# Altium schematic sheet 21_POWER_DOMAINS.SchDoc: Power Domains
size B; Author: Edward Lai; CompanyName: Vibe Inc; DrawnBy: Edward Lai; DocumentNumber: 10; SheetNumber: 10; SheetTotal: 12
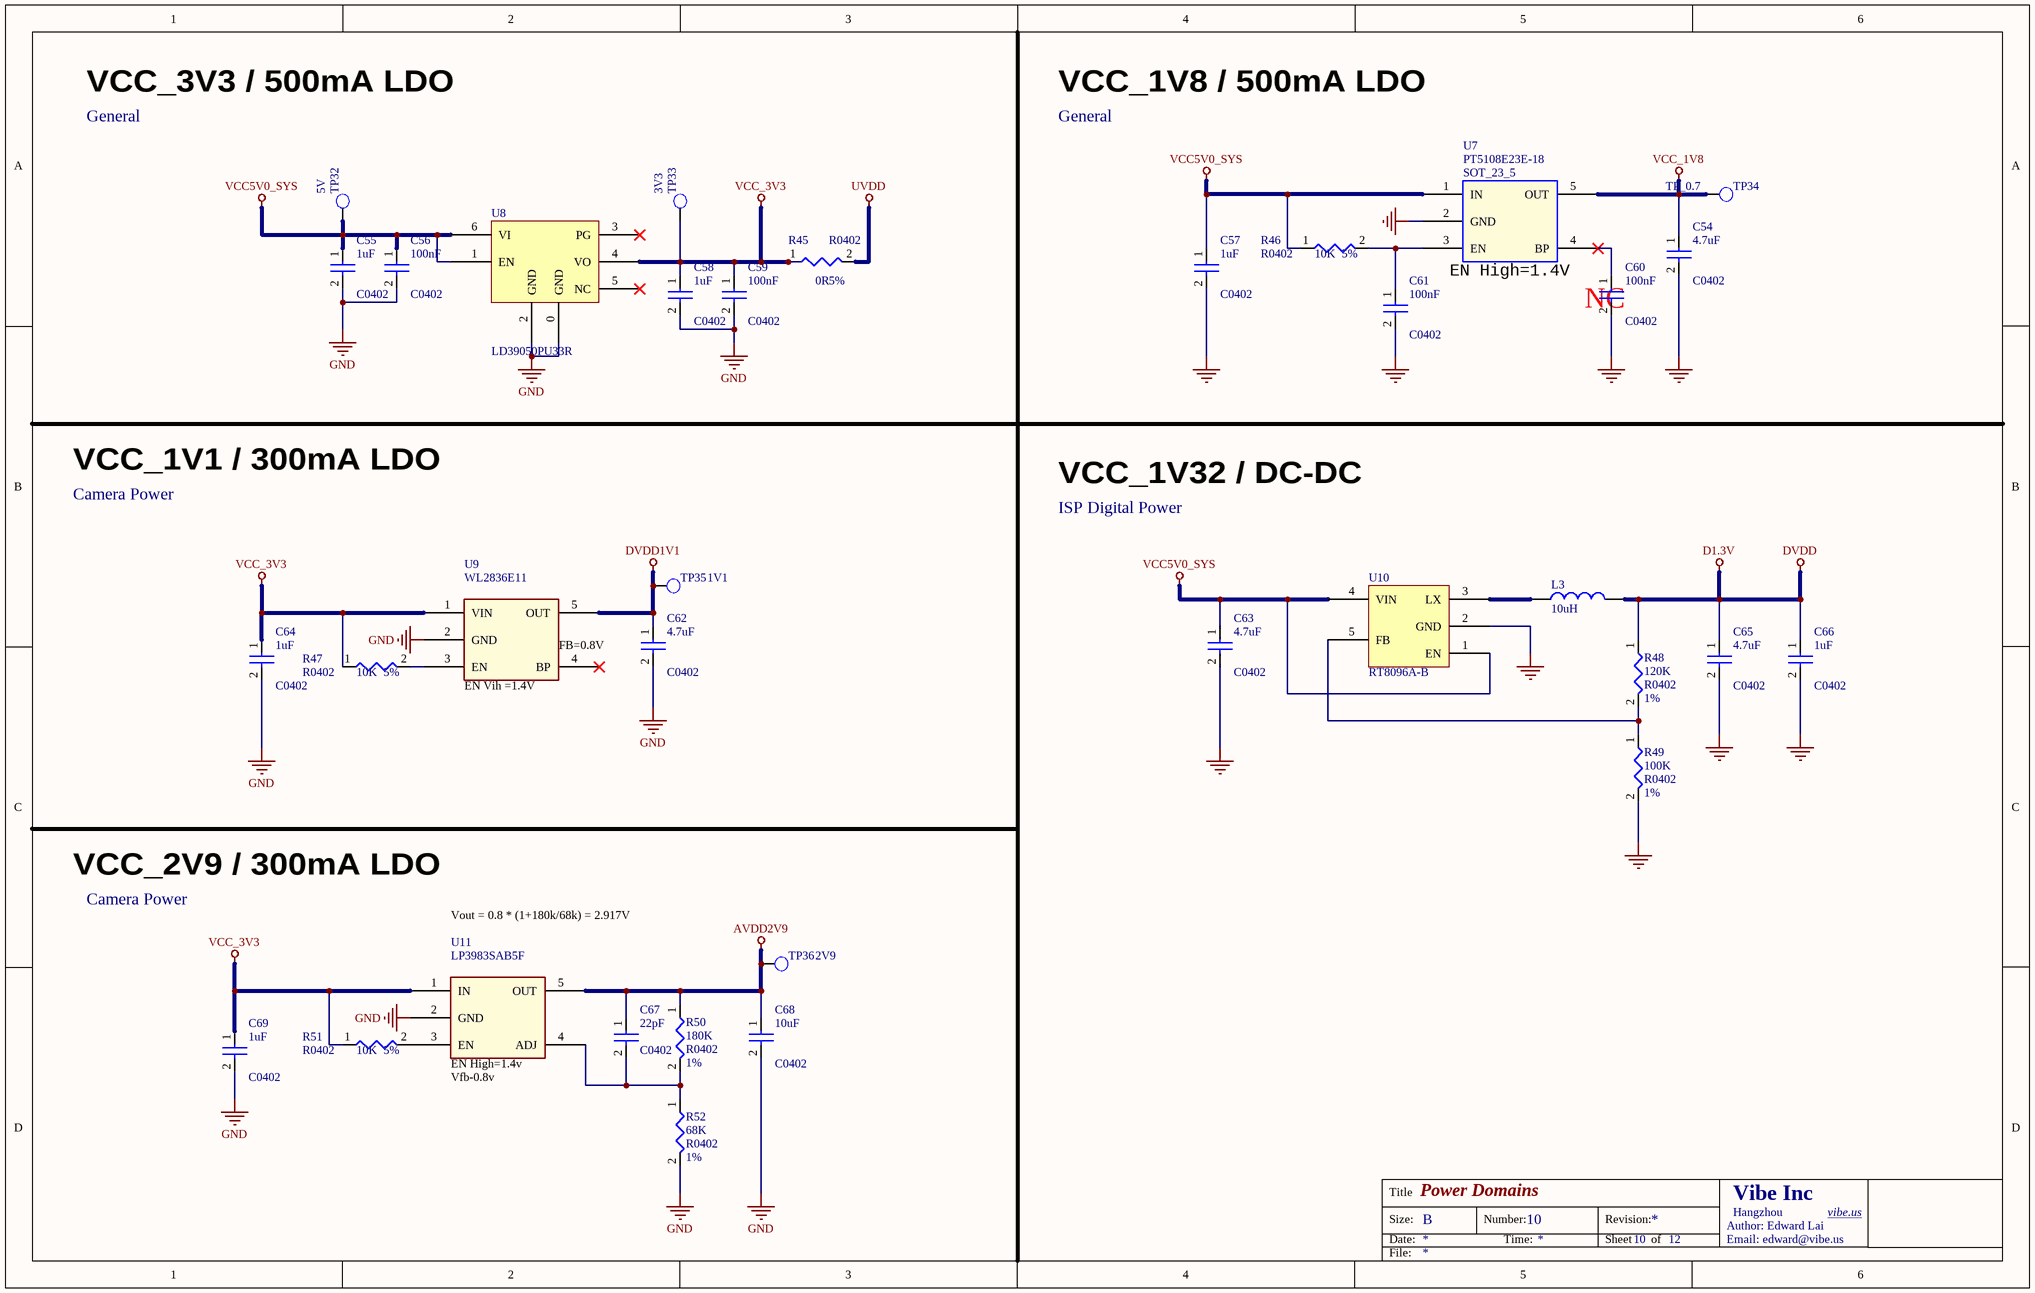
[diagram p0: 21_POWER_DOMAINS.SchDoc]

## Parts
C54  4.7uF  PCB Footprint: C0402  [C0402_L]
C55  1uF  PCB Footprint: C0402  [C0402_L]
C56  100nF  PCB Footprint: C0402  [C0402_L]
C57  1uF  PCB Footprint: C0402  [C0402_L]
C58  1uF  PCB Footprint: C0402  [C0402_L]
C59  100nF  PCB Footprint: C0402  [C0402_L]
C60  100nF  PCB Footprint: C0402  [C0402_L]  (net tie, no BOM)
C61  100nF  PCB Footprint: C0402  [C0402_L]
C62  4.7uF  PCB Footprint: C0402  [C0402_L]
C63  4.7uF  PCB Footprint: C0402  [C0402_L]
C64  1uF  PCB Footprint: C0402  [C0402_L]
C65  4.7uF  PCB Footprint: C0402  [C0402_L]
C66  1uF  PCB Footprint: C0402  [C0402_L]
C67  22pF  PCB Footprint: C0402  [C0402_L]
C68  10uF  PCB Footprint: C0402  [C0402_L]
C69  1uF  PCB Footprint: C0402  [C0402_L]
L3  10uH  [L0402]
R45  0R  Tolerance: 5%  [R0402]
R46  10K  Tolerance: 5%  [R0402]
R47  10K  Tolerance: 5%  [R0402]
R48  120K  Tolerance: 1%  [R0402]
R49  100K  Tolerance: 1%  [R0402]
R50  180K  Tolerance: 1%  [R0402]
R51  10K  Tolerance: 5%  [R0402]
R52  68K  Tolerance: 1%  [R0402]
TP32  5V  [TP_0R70]  (no BOM)
TP33  3V3  [TP_0R70]  (no BOM)
TP34  TP_0.7  [TP_0R70]  (net tie, no BOM)
TP35  1V1  [TP_0R70]  (no BOM)
TP36  2V9  [TP_0R70]  (no BOM)
U7  PT5108E23E-18  PCB Footprint: SOT_23_5  [SOT23-5]
U8  LD39050PU33R  [SON95P300X300X100-7N]
U9  WL2836E11  [SOT23-5]
U10  RT8096A-B  [SOT_23_5]
U11  LP3983SAB5F  [SOT23-5]

## Nets
AVDD2V9: C67.1 C68.1 R50.1 TP36.1 U11.5(OUT)
D1.3V: C65.1 C66.1 L3.2 R48.1  [also labelled DVDD]
DVDD1V1: C62.1 TP35.1 U9.5(OUT)
GND: C54.2 C55.2 C56.2 C57.2 C58.2 C59.2 C60.2 C61.2 C62.2 C63.2 C64.2 C65.2 C66.2 C68.2 C69.2 R49.2 R52.2 U7.2(GND) U8.0(GND) U8.2(GND) U9.2(GND) U10.2(GND) U11.2(GND)
UVDD: R45.2
VCC5V0_SYS: C55.1 C56.1 C57.1 C63.1 R46.1 TP32.1 U7.1(IN) U8.1(EN) U8.6(VI) U10.1(EN) U10.4(VIN)
VCC_1V8: C54.1 TP34.1 U7.5(OUT)
VCC_3V3: C58.1 C59.1 C64.1 C69.1 R45.1 R47.1 R51.1 TP33.1 U8.4(VO) U9.1(VIN) U11.1(IN)
NetC60_1: C60.1 U7.4(BP)
NetC61_1: C61.1 R46.2 U7.3(EN)
NetC67_2: C67.2 R50.2 R52.1 U11.4(ADJ)
NetL3_1: L3.1 U10.3(LX)
NetR47_2: R47.2 U9.3(EN)
NetR48_2: R48.2 R49.1 U10.5(FB)
NetR51_2: R51.2 U11.3(EN)

Not connected (* = marked no-connect by the designer): U8 3(PG)* 5(NC)*; U9 4(BP)*

## Notes on the sheet
- VCC_3V3 / 500mA LDO
- VCC_1V8 / 500mA LDO
- General
- (near U7) EN High=1.4V
- (near C60) NC
- VCC_1V1 / 300mA LDO
- Camera Power
- VCC_1V32 / DC-DC
- ISP Digital Power
- (near U9) EN Vih =1.4V
- (near U9) FB=0.8V
- VCC_2V9 / 300mA LDO
- Vout = 0.8 * (1+180k/68k) = 2.917V
- (near U11) EN High=1.4v
- (near U11) Vfb-0.8v
- Title
- Size:
- Date:
- B
- Number:
- Time:
- Revision:
- Sheet
- of
- Author: Edward Lai
- Email: edward@vibe.us
- Vibe Inc
- Hangzhou
- vibe.us <http://vibe.us>
- File:

## Library data of the parts
C54 C62 C63 C65 = CAP NP_Dup1: cap,4.70uF,+/-10%,6.3V,X5R,C0402; Priority: A; Part Type: C0402
C55 C58 C64 C69 = CAP NP_Dup1: cap,1.0uF,+/-10%,6.3V,X5R,C0402; Priority: A; Part Type: C0402
C56 C59 = CAP NP_Dup1: cap,1.0uF,+/-10%,6.3V,C0402; Priority: A; Part Type: C0402
C57 C66 = CAP NP_Dup1: cap,1.00uF,+/-10%,10V,X5R,C0402; Priority: A; Part Type: C0402
C60 C61 = CAP NP_Dup1: cap,100.00nF,+/-10%,10V,X5R,C0402; Priority: A; Part Type: C0402
C67 = CAP NP_Dup1: cap,22pF,+/-10%,6.3V,X5R,C0402; Priority: A; Part Type: C0402
C68 = CAP NP_Dup1: cap,10uF,+/-10%,6.3V,X5R,C0402; Priority: A; Part Type: C0402
L3 = L: 贴片小功率电感
R45 = RESISTOR: 通用厚膜电阻,0R,+/-5%,R0402; Priority: A; PCB Footprint: R0402; Part Type: 通用厚膜电阻
R46 R47 R51 = RESISTOR: 通用厚膜电阻,10K,+/-5%,R0402; Priority: A; PCB Footprint: R0402; Part Type: 通用厚膜电阻
R48 R50 = RESISTOR: 通用厚膜电阻,180K,+/-1%,R0402,1/16W.; Priority: A; PCB Footprint: R0402; Part Type: 通用厚膜电阻
R49 = RESISTOR: 通用厚膜电阻,100K,+/-1%,R0402; Priority: A; PCB Footprint: R0402; Part Type: 通用厚膜电阻
R52 = RESISTOR: 通用厚膜电阻,68K,+/-1%,R0402; Priority: A; PCB Footprint: R0402; Part Type: 通用厚膜电阻
TP32-TP36 = TP: Test Point 0.7mm; PCB Footprint: TP_0R50; Priority: A; Part Type: TP
U7 = LDO_PT5108: High-PSRR 600mA LDO.Output1.8V.; Priority: A; Part Type: LDO
U8 = LD39050PU33R: LD39050PU33R / 6-DFN (3x3) / Output 500mA
U9 = DCDC_WL2836E: WL2836E11 DCDC for CMOS Sensor
U10 = RT8096A-B: RT8096A-B / SOT-23-5
U11 = DCDC_LP3983S: LP3983SAB5F 2V9 DCfor CMOS SensorSOT_23_5